# Altium schematic sheet 1_P1.schdoc.schdoc
size 220 x 160 mm; Symbol: Sheet-Symbol_A4; Device: Sheet-Symbol_A4; Company: 杭州科技职业技术学院; Version: V1.0; Page Size: A5; @Project Name: 2024毕设; @Page Count: 1; @Update Date: 2024-04-29; @Create Date: 2024-04-29; @Schematic Name: 滴速检测模块; @Page No: 1; @Page Name: P1
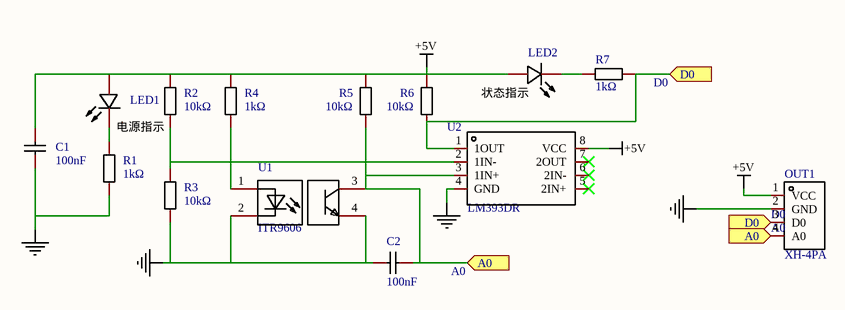
[diagram p0: 1_P1.schdoc.schdoc]

## Parts
C1  100nF  [C0805]
C2  100nF  [C0805]
LED1  NCD0805R1  [LED0805-R-RD]  (value not drawn)
LED2  NCD0805R1  [LED0805-R-RD]  (value not drawn)
OUT1  XH-4PA  [槽型光耦]
R1  1kΩ  [R0805]
R2  10kΩ  [R0805]
R3  10kΩ  [R0805]
R4  1kΩ  [R0805]
R5  10kΩ  [R0805]
R6  10kΩ  [R0805]
R7  1kΩ  [R0805]
U1  ITR9606  [OPTO-TH_4P_ITR9606]
U2  LM393DR  [SOIC-8_L5.0-W4.0-P1.27-LS6.0-BL]

## Ports
A0 (in), D0 (in)

## Nets
+5V: C1.2 LED1.1(+) LED2.1(+) OUT1.1(VCC) R2.2 R4.2 R5.2 R6.2 U2.8(VCC)
NetC1_1: C1.1 C2.2 OUT1.2(GND) R1.1 R3.1 U1.2 U1.4 U2.4(GND)
A0: C2.1 OUT1.4(A0) R5.1 U1.3 U2.3(1IN+) ; port A0
D0: OUT1.3(D0) R6.1 R7.1 U2.1(1OUT) ; port D0
NetLED1_2: LED1.2(-) R1.2
NetLED2_2: LED2.2(-) R7.2
NetR2_1: R2.1 R3.2 U2.2(1IN-)
NetR4_1: R4.1 U1.1

Not connected (* = marked no-connect by the designer): U2 5(2IN+)* 6(2IN-)* 7(2OUT)*

## Notes on the sheet
- (near LED2) 状态指示
- 电源指示
- 1
- 2
- 3
- 4
- 5
- 6
- A
- B
- C
- 原理图
- 滴速检测模块
- 创建日期
- 更新日期
- 2024-04-29
- 审阅
- 绘制
- 图页
- P1
- 物料编码
- 2024毕设
- D
- 版本
- 尺寸
- 页
- 共
- V1.0
- A5
- 杭州科技职业技术学院

## Library data of the parts
C1 C2 = 0805B104K500NT: Manufacturer: FH(风华); Add into BOM: yes; Tolerance: ±10%; Voltage Rated: 50V; Temperature Coefficient: X7R; Description: 容值:100nF;精度:±10%;额定电压:50V;材质(温度系数):X7R;; Name: 100nF; Symbol: 0805B104K500NT; Device: 0805B104K500NT; Supplier: LCSC; Manufacturer Part: 0805B104K500NT; Value: 100nF; Supplier Part: C38141; JLCPCB Part Class: 扩展库; LCSC Part Name: 100nF ±10% 50V; Supplier Footprint: 0805; Datasheet: https://atta.szlcsc.com/upload/public/pdf/source/20200305/C486355_26A10D38EF8C2A5C37091D0039909270.pdf; Convert to PCB: yes
LED1 LED2 = NCD0805R1: Manufacturer: 国星光电; Symbol: FC-2012HRK-620D; Add into BOM: yes; Emitted Color: 红色; Forward Voltage (VF): 1.6V~2.6V; Power Dissipation: 65mW; Forward Current: 20mA; Dominant Wavelength: 615nm~630nm; Diode Configuration: 独立二极管; Lens Color: 无色透明透镜; Luminous Intensity: 67mcd~195mcd; Viewing Angle: 130°; Description: 灯头类型:-;发光颜色:红色;正向电压(VF):1.6V~2.6V;功率:65mW;正向电流:20mA;主波长:615nm~630nm;二极管配置:独立二极管;透镜颜色:无色透明透镜;色温:-;发光强度:67mcd~195mcd;发光角度:130°;载带方式:-;工作温度:-30℃~+85℃;; Device: NCD0805R1; Supplier: LCSC; Manufacturer Part: NCD0805R1; Supplier Part: C84256; JLCPCB Part Class: 基础库; LCSC Part Name: NCD0805R1; Supplier Footprint: 0805; Datasheet: https://atta.szlcsc.com/upload/public/pdf/source/20200820/C84256_F0A75A43B3EAD75808600A0514C76B99.pdf; Convert to PCB: yes; Lamp Holder Type: -; Peak Wavelength: -; Color Temperature: -; Mounting Sytle: -; Operating Temperature: -30℃~+85℃
  LED1: Name: NCD0805R1
OUT1 = XH-4PA: Manufacturer: ZHOURI(洲日); Add into BOM: yes; Name: XH-4PA; Symbol: XH-4PA; Device: XH-4PA; LCSC Part Name: XH-4PA; Supplier Part: C5258885; Manufacturer Part: XH-4PA; Supplier Footprint: 插件,P=2.5mm; JLCPCB Part Class: 扩展库; Datasheet: https://atta.szlcsc.com/upload/public/pdf/source/20221111/941C48A64A881023E1ECD9BB647261A0.pdf; Supplier: LCSC; Convert to PCB: yes
R1 R4 R7 = 0805W8F1001T5E: Manufacturer: UNI-ROYAL(厚声); Add into BOM: yes; Tolerance: ±1%; Power(Watts): 125mW; Overload Voltage (Max): 150V; Temperature Coefficient: ±100ppm/℃; Description: 电阻类型:厚膜电阻;阻值:1kΩ;精度:±1%;功率:125mW;最大工作电压:150V;温度系数:±100ppm/℃;; Name: 1kΩ; Symbol: 0805W8F1001T5E; Device: 0805W8F1001T5E; LCSC Part Name: 1kΩ ±1% 125mW 厚膜电阻; Supplier Part: C17513; Manufacturer Part: 0805W8F1001T5E; Supplier Footprint: 0805; JLCPCB Part Class: 基础库; Datasheet: https://atta.szlcsc.com/upload/public/pdf/source/20200306/C422600_1E6D84923E4A46A82E41ADD87F860B5C.pdf; Supplier: LCSC; Convert to PCB: yes; Type: 厚膜电阻; Value: 1kΩ; Operating Temperature Range: -55℃~+155℃
R2 R3 R5 R6 = 0805W8F1002T5E_C17414: Manufacturer: UNI-ROYAL(厚声); Add into BOM: yes; Tolerance: ±1%; Power(Watts): 125mW; Overload Voltage (Max): 150V; Temperature Coefficient: ±100ppm/℃; Description: 电阻类型:厚膜电阻;阻值:10kΩ;精度:±1%;功率:125mW;最大工作电压:150V;温度系数:±100ppm/℃;; Name: 10kΩ; Symbol: 0805W8F1002T5E; Device: 0805W8F1002T5E_C17414; Supplier: LCSC; Manufacturer Part: 0805W8F1002T5E; Supplier Part: C17414; Value: 10kΩ; JLCPCB Part Class: 基础库; LCSC Part Name: 10kΩ ±1% 125mW 厚膜电阻; Supplier Footprint: 0805; Datasheet: https://atta.szlcsc.com/upload/public/pdf/source/20200306/C422600_1E6D84923E4A46A82E41ADD87F860B5C.pdf; Convert to PCB: yes; Type: 厚膜电阻; Operating Temperature Range: -55℃~+155℃
U1 = ITR9606: Manufacturer: EVERLIGHT(亿光); Add into BOM: yes; Name: ITR9606; Symbol: ITR9606; Device: ITR9606; LCSC Part Name: 5mm 光中断器; Supplier Part: C264271; Manufacturer Part: ITR9606; Supplier Footprint: DIP-4; JLCPCB Part Class: 扩展库; Datasheet: https://atta.szlcsc.com/upload/public/pdf/source/20180817/C264271_0A5A08AFBE67158755A762373070CED7.pdf; Supplier: LCSC; Convert to PCB: yes
U2 = LM393DR: Manufacturer: TI(德州仪器); Add into BOM: yes; Input Offset Voltage (Vos): 5mV; Input Bias Current (Ib): 250nA; Supply Voltage: 1V~18V；2V~36V; Output Type: 开集; Supply Current: 2.5mA; Description: 输入失调电压(Vos):5mV;输入偏置电流(Ib):250nA;; Name: LM393DR; Symbol: LM393DR; Device: LM393DR; LCSC Part Name: LM393DR; Supplier Part: C67470; Manufacturer Part: LM393DR; Supplier Footprint: SOIC-8; JLCPCB Part Class: 扩展库; Datasheet: https://www.ti.com/cn/lit/gpn/lm393; Supplier: LCSC; Convert to PCB: yes; Input Hysteresis Voltage (Vhys): -; Common Mode Rejection Ratio (CMRR): -; Output Mode: -; Operating Temperature: 0℃~+70℃